# EAGLE design 2Cel_Bank (EAGLE 7.1.0)

## Sheet 1 of 2
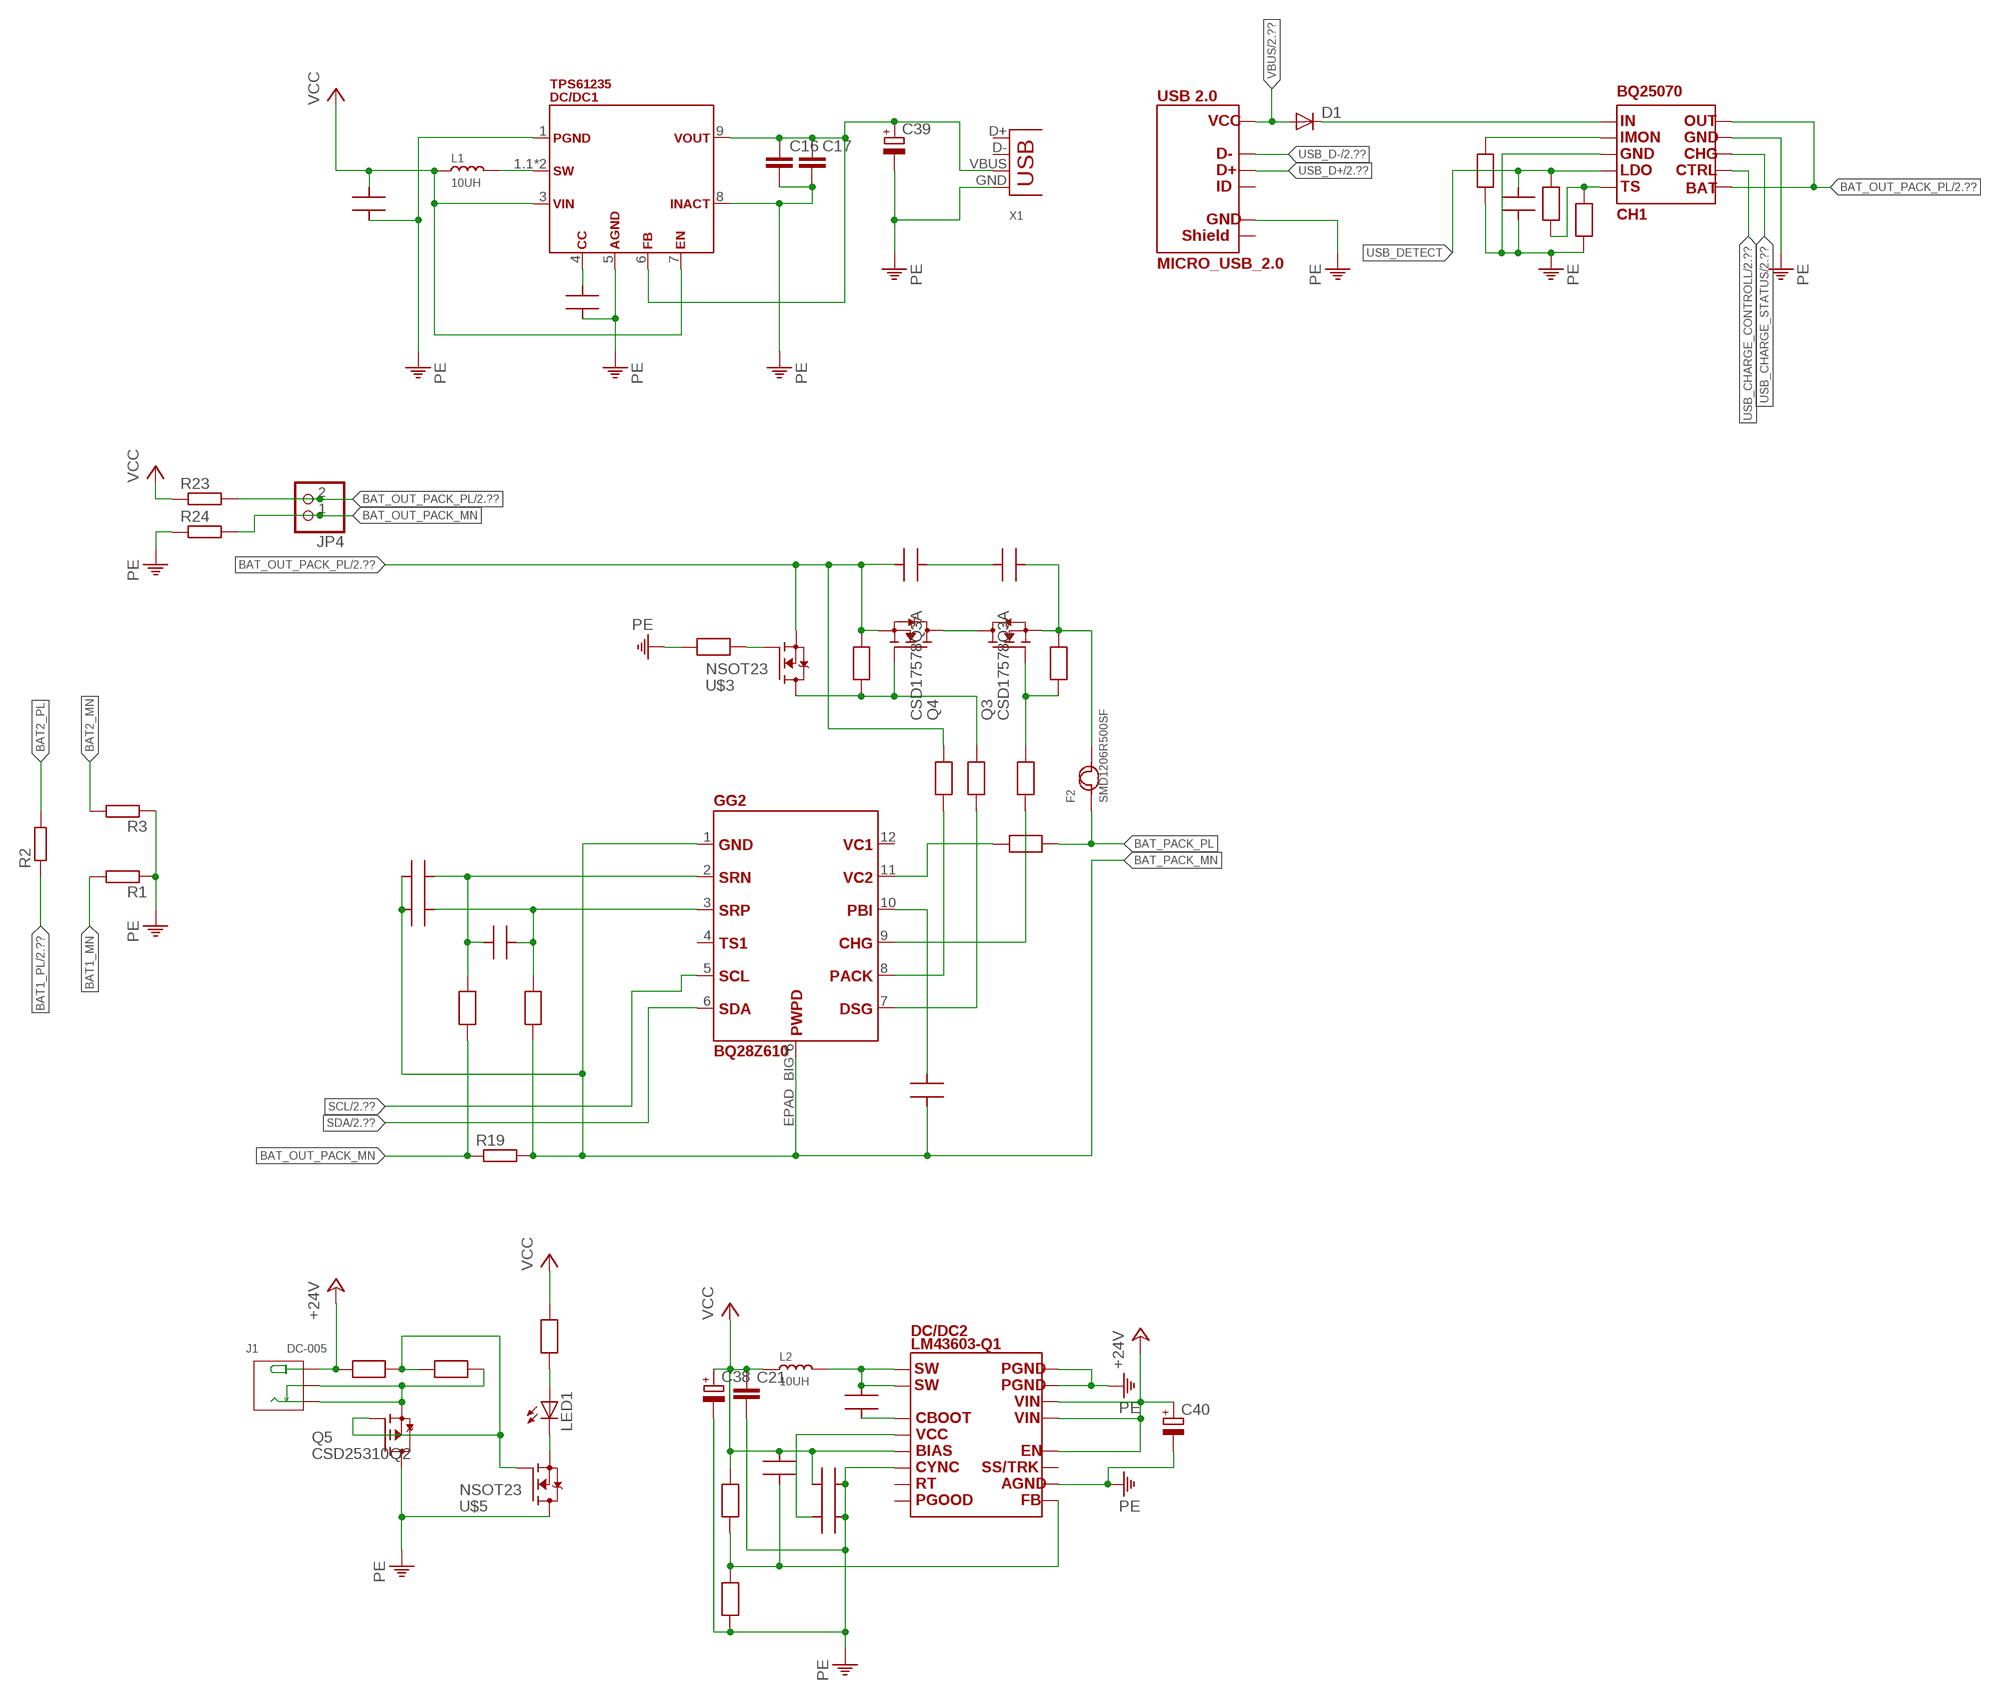
[diagram p0: schematic, sheet 1]

### Parts
C7  CAP0603  [C0603]
C8  CAP0603  [C0603]
C9  CAP0603  [C0603]
C10  CAP0603  [C0603]
C11  CAP0603  [C0603]
C12  CAP0603  [C0603]
C13  CAP0603  [C0603]
C14  CAP0603  [C0603]
C16  C-EUC0805  [C0805]
C17  C-EUC0805  [C0805]
C18  CAP0603  [C0603]
C19  CAP0603  [C0603]
C20  CAP0603  [C0603]
C21  C-EUC0805  [C0805]
C22  CAP0603  [C0603]
C33  CAP0603  [C0603]
C38  CPOL-EUSMCA  [SMC_A]
C39  CPOL-EUSMCA  [SMC_A]
C40  CPOL-EUSMCD  [SMC_D]
CH1  BQ25070  [DFN10_2X3]
D1  DIODE-DO-214AC  [DO-214AC]
DC/DC1  TPS61235  [VQFN9]
DC/DC2  LM43603-Q1  [HTSSOP16PWP]
F2  SMD1206R500SF  SMD-PPTC-500MA-15V(1812)  [F1812]
GG2  BQ28Z610  [VSON12]
J1  DC-005  CONN-POWER-JACK-2.1MM(DC-005)  [DCJ3P-14.2X11.0X9.0MM]
JP4  PINHD-1X2  [1X02]
L1  10UH  SMD-INDUCTOR-10UH-20%(2P-6X6MM)'0630'  [SMD-2P-L6.0XW6.0XH3.0MM]
L2  10UH  SMD-INDUCTOR-10UH-20%(2P-6X6MM)'0630'  [SMD-2P-L6.0XW6.0XH3.0MM]
LED1  LEDCHIP-LED0603  [CHIP-LED0603]
Q3  CSD17578Q3A  [VSONP8]
Q4  CSD17578Q3A  [VSONP8]
Q5  CSD25310Q2  [SON_Q2]
R1  R-EU_R1206  [R1206]
R2  R-EU_R1206  [R1206]
R3  R-EU_R1206  [R1206]
R11  RES0603  [R0603]
R12  RES0603  [R0603]
R13  RES0603  [R0603]
R14  RES0603  [R0603]
R15  RES0603  [R0603]
R16  RES0603  [R0603]
R17  RES0603  [R0603]
R18  RES0603  [R0603]
R19  R-EU_R1206  [R1206]
R20  RES0603  [R0603]
R22  RES0603  [R0603]
R23  R-EU_R1206  [R1206]
R24  R-EU_R1206  [R1206]
R25  RES0603  [R0603]
R26  RES0603  [R0603]
R27  RES0603  [R0603]
R28  RES0603  [R0603]
R29  RES0603  [R0603]
R30  RES0603  [R0603]
R31  RES0603  [R0603]
U$3  NSOT23  [SOT23W]
U$5  NSOT23  [SOT23W]
USB_CON1  MICRO_USB_2.0  [MICRO-USB5+4P-SMD-0.65]
X1  USB-A-S  [USB-A-S]

### Nets
+24V: C40.+ DC/DC2.12 DC/DC2.13 DC/DC2.14 J1.+ R25.2
BAT1_MN: R1.2
BAT1_PL: R2.1 ; also sheet 2
BAT2_MN: R3.2
BAT2_PL: R2.2
BAT_OUT_PACK_MN: JP4.1 R17.1 R19.1 R24.2
BAT_OUT_PACK_PL: C7.1 CH1.P$6 CH1.P$10 JP4.2 Q4.S1(S) Q4.S2(S) Q4.S3(S) R12.2 R15.2 R23.2 U$3.S ; also sheet 2
BAT_PACK_MN: C9.1 C10.2 C11.2 GG2.1 GG2.EPAD_BIG GG2.EPAD_M1 GG2.EPAD_M2 GG2.EPAD_M3 GG2.EPAD_M4 GG2.EPAD_VIA R18.1 R19.2
BAT_PACK_PL: F2.1 R20.1
N$11: C8.2 F2.2 Q3.S1(S) Q3.S2(S) Q3.S3(S) R11.2
N$16: Q3.D1(D) Q3.D2(D) Q3.D3(D) Q3.D4(D) Q3.D5(D) Q4.D1(D) Q4.D2(D) Q4.D3(D) Q4.D4(D) Q4.D5(D)
N$17: Q4.G R12.1 R13.2 U$3.D
N$18: Q3.G R11.1 R14.2
N$19: C7.2 C8.1
N$20: GG2.9 R14.1
N$21: GG2.7 R13.1
N$22: GG2.8 R15.1
N$23: R16.1 U$3.G
N$24: C9.2 GG2.10
N$25: C10.1 C12.2 GG2.2 R17.2
N$26: C11.1 C12.1 GG2.3 R18.2
N$28: GG2.11 R20.2
N$29: J1.-1(-) J1.-2(CDN) Q5.4(D) Q5.D R26.1
N$30: DC/DC1.1.1 DC/DC1.1.2 L1.2
N$31: Q5.3(G) R25.1 R26.2 U$5.G
N$32: C13.2 DC/DC1.4
N$33: C18.2 DC/DC2.1 DC/DC2.2 L2.2
N$34: C16.1 C17.1 C39.+ DC/DC1.6 DC/DC1.9 X1.VBUS
N$35: C18.1 DC/DC2.3
N$37: C19.2 DC/DC2.4
N$38: C22.2 DC/DC2.9 R27.2 R28.2
N$41: CH1.P$1 D1.C
N$42: CH1.P$2 R22.2
N$43: LED1.C U$5.S
N$44: CH1.P$5 R29.2 R30.1
N$46: LED1.A R31.2
PE: C13.1 C14.1 C16.2 C17.2 C19.1 C20.1 C21.2 C33.1 C38.- C39.- C40.- CH1.EPAD CH1.P$3 CH1.P$9 DC/DC1.1 DC/DC1.5 DC/DC1.8 DC/DC2.6 DC/DC2.10 DC/DC2.15 DC/DC2.16 DC/DC2.EXP Q5.1(S) Q5.2(S) Q5.5(S) Q5.6(S) Q5.S R1.1 R3.1 R16.2 R22.1 R24.1 R28.1 R29.1 U$5.D USB_CON1.5 X1.GND ; also sheet 2
SCL: GG2.5 ; also sheet 2
SDA: GG2.6 ; also sheet 2
USB_CHARGE_CONTROLL: CH1.P$7 ; also sheet 2
USB_CHARGE_STATUS: CH1.P$8 ; also sheet 2
USB_D+: USB_CON1.3 ; also sheet 2
USB_D-: USB_CON1.2 ; also sheet 2
USB_DETECT: C33.2 CH1.P$4 R30.2
VBUS: D1.A USB_CON1.1 ; also sheet 2
VCC: C14.2 C20.2 C21.1 C22.1 C38.+ DC/DC1.3 DC/DC1.7 DC/DC2.5 L1.1 L2.1 R23.1 R27.1 R31.1
Unconnected: DC/DC2.7 DC/DC2.8 DC/DC2.11 GG2.4 GG2.12 USB_CON1.4 USB_CON1.P$1 USB_CON1.P$2 USB_CON1.P$3 USB_CON1.P$4 X1.D+ X1.D-

## Sheet 2 of 2
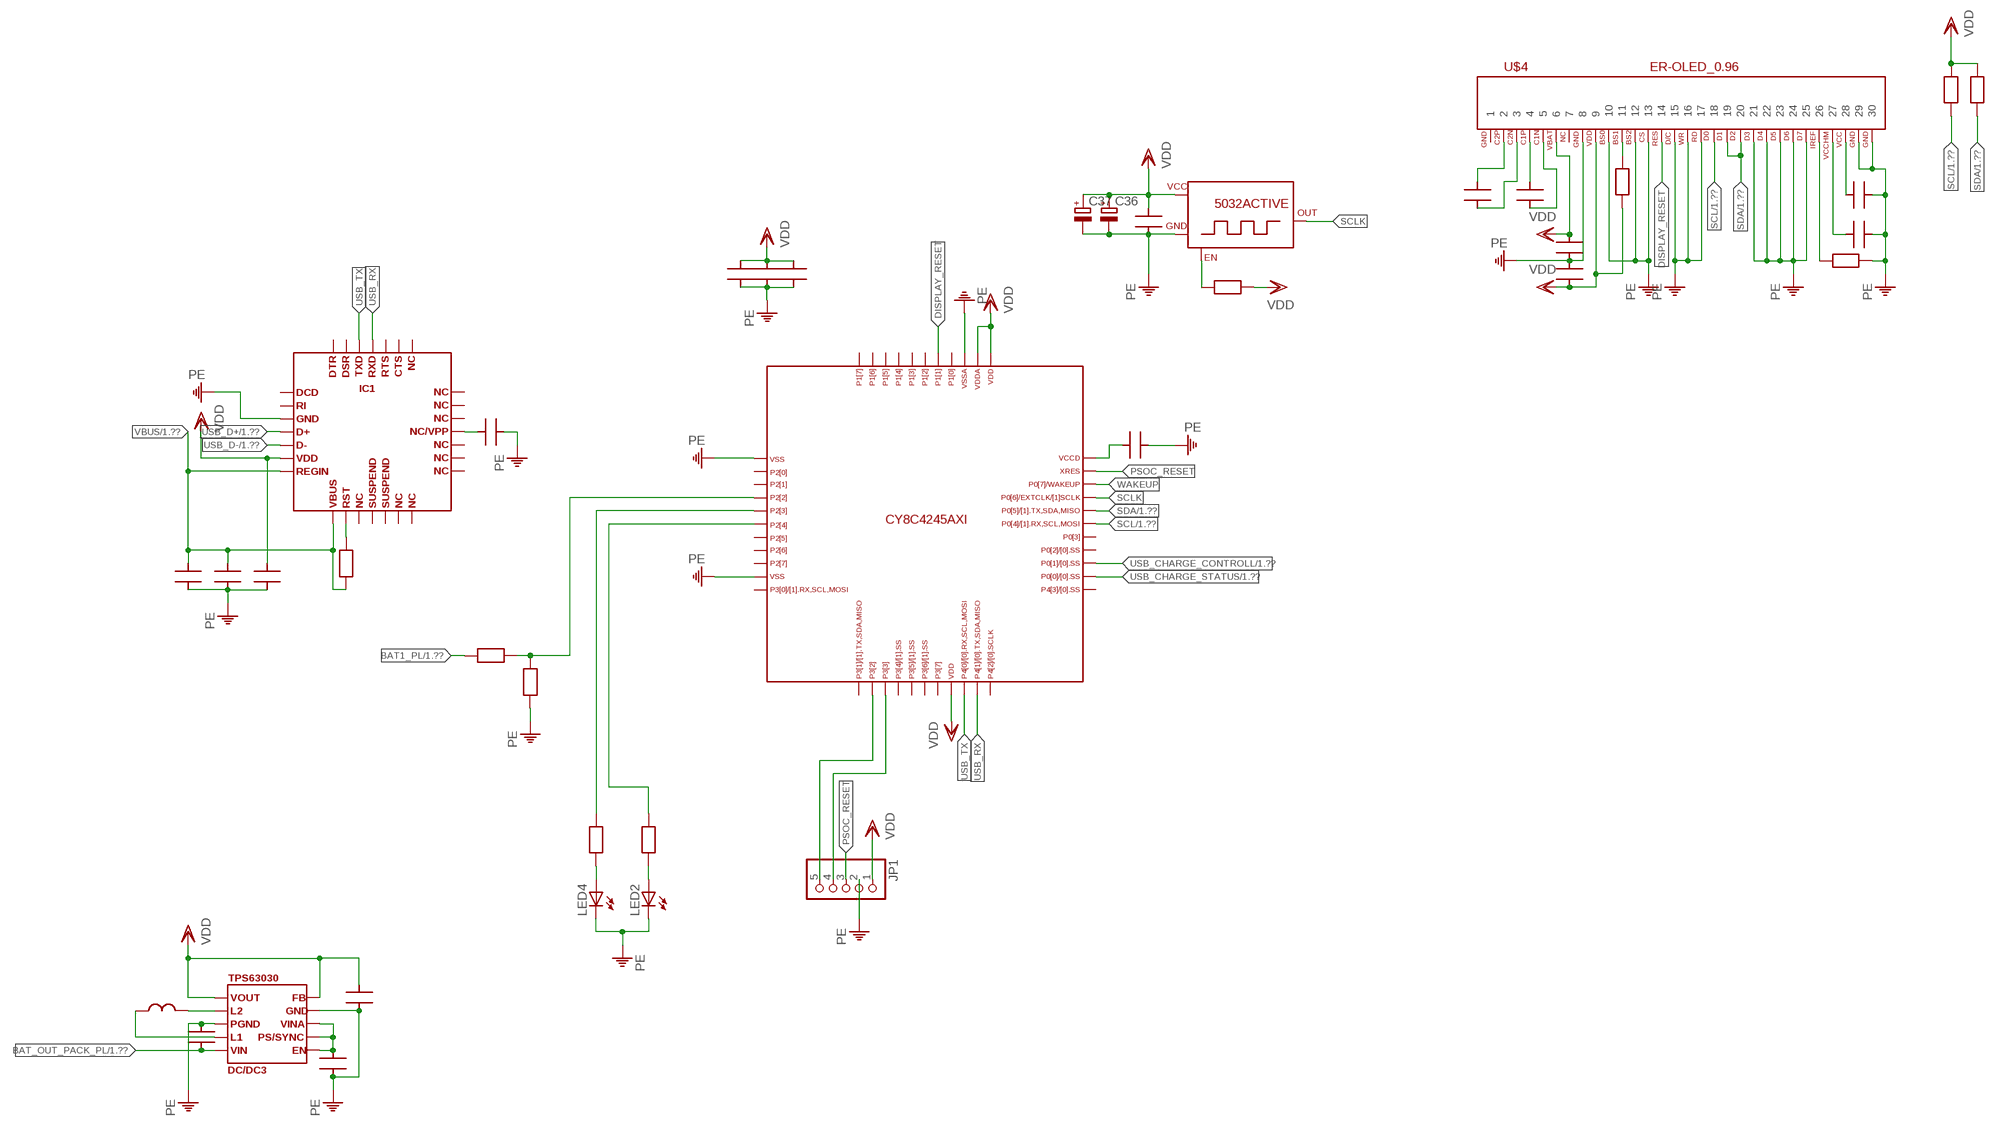
[diagram p1: schematic, sheet 2]

### Parts
C1  CAP0603  [C0603]
C2  CAP0603  [C0603]
C3  CAP0603  [C0603]
C4  CAP0603  [C0603]
C5  CAP0603  [C0603]
C6  CAP0603  [C0603]
C23  CAP0603  [C0603]
C24  CAP0603  [C0603]
C25  CAP0603  [C0603]
C26  CAP0603  [C0603]
C27  CAP0603  [C0603]
C28  CAP0603  [C0603]
C29  CAP0603  [C0603]
C30  CAP0603  [C0603]
C31  CAP0603  [C0603]
C32  CAP0603  [C0603]
C34  CAP0603  [C0603]
C35  CAP0603  [C0603]
C36  CPOL-EUSMCA  [SMC_A]
C37  CPOL-EUSMCA  [SMC_A]
DC/DC3  TPS63030  [WSON10]
IC1  CP2102/9  [QFN-28]
JP1  PINHD-1X5  [1X05]
L3  L0603  [L0603]
LED2  LEDCHIP-LED0603  [CHIP-LED0603]
LED4  LEDCHIP-LED0603  [CHIP-LED0603]
R4  RES0603  [R0603]
R5  RES0603  [R0603]
R6  RES0603  [R0603]
R7  RES0603  [R0603]
R8  RES0603  [R0603]
R9  RES0603  [R0603]
R10  RES0603  [R0603]
R21  RES0603  [R0603]
R32  RES0603  [R0603]
R33  RES0603  [R0603]
U$1  CY8C4245  [TQFP44_CY_LOGO]
U$2  5032ACTIVE  [5030A]
U$4  ER-OLED_0.96  [30PIN]

### Nets
BAT1_PL: R10.2 ; also sheet 1
BAT_OUT_PACK_PL: C30.2 DC/DC3.P$5 ; also sheet 1
DISPLAY_RESET: U$1.38 U$4.14
N$1: C1.2 IC1.18
N$2: IC1.9 R4.2
N$3: JP1.5 U$1.13
N$4: JP1.4 U$1.14
N$5: C5.2 U$1.33
N$6: R5.2 U$2.1(EN)
N$7: C23.1 U$4.2
N$8: C24.1 U$4.4
N$9: C23.2 U$4.3
N$10: C24.2 U$4.5
N$12: C28.1 U$4.27
N$13: R6.2 U$4.26
N$14: R10.1 R21.1 U$1.4
N$15: C27.1 U$4.28
N$27: R7.1 U$4.11
N$36: DC/DC3.P$2 L3.2
N$39: DC/DC3.P$4 L3.1
N$40: C29.1 DC/DC3.P$6 DC/DC3.P$7 DC/DC3.P$8
N$47: R33.1 U$1.5
N$48: LED2.A R32.2
N$49: LED4.A R33.2
N$50: R32.1 U$1.6
PE: C1.1 C2.2 C3.2 C4.2 C5.1 C6.2 C25.1 C26.2 C27.2 C28.2 C29.2 C30.1 C31.2 C32.2 C34.2 C35.2 C36.- C37.- DC/DC3.EPAD_B DC/DC3.EPAD_T DC/DC3.EPAD_VIA DC/DC3.P$3 DC/DC3.P$9 IC1.3 IC1.EPAD_B IC1.EPAD_T IC1.EPAD_VIA1 IC1.EPAD_VIA2 IC1.EPAD_VIA3 IC1.EPAD_VIA4 IC1.EPAD_VIA5 IC1.EPAD_VIA6 IC1.EPAD_VIA7 IC1.EPAD_VIA8 IC1.EPAD_VIA9 JP1.2 LED2.C LED4.C R6.1 R21.2 U$1.1 U$1.10 U$1.36 U$2.2(GND) U$4.8 U$4.10 U$4.12 U$4.13 U$4.15 U$4.16 U$4.17 U$4.21 U$4.22 U$4.23 U$4.24 U$4.25 U$4.29 U$4.30 ; also sheet 1
PSOC_RESET: JP1.3 U$1.32
SCL: R8.2 U$1.28 U$4.18 ; also sheet 1
SCLK: U$1.30 U$2.3(OUT)
SDA: R9.2 U$1.29 U$4.19 U$4.20 ; also sheet 1
USB_CHARGE_CONTROLL: U$1.25 ; also sheet 1
USB_CHARGE_STATUS: U$1.24 ; also sheet 1
USB_D+: IC1.4 ; also sheet 1
USB_D-: IC1.5 ; also sheet 1
USB_RX: IC1.25 U$1.21
USB_TX: IC1.26 U$1.20
VBUS: C2.1 C3.1 IC1.7 IC1.8 R4.1 ; also sheet 1
VDD: C4.1 C6.1 C25.2 C26.1 C31.1 C32.1 C34.1 C35.1 C36.+ C37.+ DC/DC3.P$1 DC/DC3.P$10 IC1.6 JP1.1 R5.1 R7.2 R8.1 R9.1 U$1.19 U$1.34 U$1.35 U$2.4(+5V) U$4.6 U$4.9
WAKEUP: U$1.31
Unconnected: IC1.1 IC1.2 IC1.10 IC1.11 IC1.12 IC1.13 IC1.14 IC1.15 IC1.16 IC1.17 IC1.19 IC1.20 IC1.21 IC1.22 IC1.23 IC1.24 IC1.27 IC1.28 U$1.2 U$1.3 U$1.7 U$1.8 U$1.9 U$1.11 U$1.12 U$1.15 U$1.16 U$1.17 U$1.18 U$1.22 U$1.23 U$1.26 U$1.27 U$1.37 U$1.39 U$1.40 U$1.41 U$1.42 U$1.43 U$1.44 U$4.1 U$4.7

## Library data of the parts
C1-C14 C18-C20 C22-C35 = My_RLC:CAP0603: Ceramic Capasitor SMD 0603
C16 C17 C21 = rcl:C-EU: CAPACITOR, European symbol
C36-C40 = rcl:CPOL-EU: POLARIZED CAPACITOR, European symbol
CH1 = My_TI:BQ25070: 1A, Single-Input, Single-Cell LiFePO4 Linear Battery Charger with 50mA LDO
D1 = diode:DIODE-: DIODE
DC/DC1 = My_TI:TPS61235: TPS61235 8-A Valley Current Synchronous Boost Converters with Constant Current Output Feature. • Up to 97% Efficiency Synchronous Boost. • Up to 3.5-A IOUT for 3.3-V to 5-V Conversion. • Fixed 5.1-V Output Voltage. Datasheet <http://www.ti.com/lit/ds/symlink/tps61235.pdf>
DC/DC2 = My_TI:LM43603-Q1: LM43603-Q1 SIMPLE SWITCHER® 3.5 V to 36 V 3 A Synchronous Step-Down Voltage Converter. Datasheet <http://www.ti.com/lit/ds/symlink/lm43603-q1.pdf>
DC/DC3 = My_TI:TPS63030: HIGH EFFICIENCY SINGLE INDUCTOR BUCK-BOOST CONVERTER WITH 1-A SWITCHES. Input Voltage Range: 1.8V to 5.5V. http://www.ti.com/lit/ds/symlink/tps63030.pdf
F2 = Seeed-OPL-fuse:SMD-PPTC-500MA-15V(1812): 307010007; MPN: SMD1206R500SF
GG2 = My_TI:BQ28Z610: BQ28Z610 Impedance Track™ Gas Gauge and Protection Solution for 1-Series to 2-Series Cell Li-Ion Battery Packs. • Cell Balancing with Internal Bypass To Optimize Battery Health. • High-Side Protection N-CH FET Drive Allows Serial Bus Communication During Fault Conditions. • Programmable Protection Levels for Voltage, Current, and Temperature. Datasheet <http://www.ti.com/lit/ds/symlink/bq28z610.pdf>
IC1 = Interface:CP2102/9: CP2102/9 SINGLE-CHIP USB TO UART BRIDGE. Integrated USB transceiver; no external resistors requied. Integrated clock; no external crystal required. Internal 1024-byte programmable ROM for vendor ID product ID, serial number, power descriptor, release number, and product description strings. - EEPROM (CP2102). - EPROM (One-time programmable) (CP2109). Datasheet <https://www.silabs.com/Support%20Documents/TechnicalDocs/CP2102-9.pdf>
J1 = Seeed-OPL-Connector:CONN-POWER-JACK-2.1MM(DC-005): 320120003; MPN: DC-005
JP1 = pinhead:PINHD-1X5: PIN HEADER
JP4 = pinhead:PINHD-1X2: PIN HEADER
L1 L2 = Seeed-OPL-Inductor:SMD-INDUCTOR-10UH-20%(2P-6X6MM): 303010016; MPN: CSAB0630-100M
L3 = My_RLC:L0603: Inductor SMD 0603
LED1 LED2 LED4 = led:LED: LED OSRAM: - CHIPLED LG R971, LG N971, LY N971, LG Q971, LY Q971, LO R971, LY R971 LH N974, LH R974 LS Q976, LO Q976, LY Q976 LO Q996 - Hyper CHIPLED LW Q18S LB Q993, LB Q99A, LB R99A - SideLED LS A670, LO A670, LY A670, LG A670, LP A670 LB A673, LV A673, LT A673, LW A673 LH A674 LY A675 LS A676, LA A676, LO A676, LY A676, LW A676 LS A679, LY A679, LG A679 - Hyper Micro SIDELED® LS Y876, LA Y876, LO Y876, LY Y876 LT Y87S - SmartLED LW L88C, LW L88S LB L89C, LB L89S, LG L890 LS L89K, LO L89K, LY L89K LS L896, LA L896, LO L896, LY L896 - TOPLED LS T670, LO T670, LY T670, LG T670, LP T670 LSG T670, LSP T670, LSY T670, LOP T670, LYG T670 LG T671, LOG T671, LSG T671 LB T673, LV T673, LT T673, LW T673 LH T674 LS T676, LA T676, LO T676, LY T676, LB T676, LH T676, LSB T676, LW T676 LB T67C, LV T67C, LT T67C, LS T67K, LO T67K, LY T67K, LW E67C LS E67B, LA E67B, LO E67B, LY E67B, LB E67C, LV E67C, LT E67C LW T67C LS T679, LY T679, LG T679 LS T770, LO T770, LY T770, LG T770, LP T770 LB T773, LV T773, LT T773, LW T773 LH T774 LS E675, LA E675, LY E675, LS T675 LS T776, LA T776, LO T776, LY T776, LB T776 LHGB T686 LT T68C, LB T68C - Hyper Mini TOPLED® LB M676 - Mini TOPLED Santana® LG M470 LS M47K, LO M47K, LY M47K Source: http://www.osram.convergy.de LUXEON: - LUMILED® LXK2-PW12-R00, LXK2-PW12-S00, LXK2-PW14-U00, LXK2-PW14-V00 LXK2-PM12-R00, LXK2-PM12-S00, LXK2-PM14-U00 LXK2-PE12-Q00, LXK2-PE12-R00, LXK2-PE12-S00, LXK2-PE14-T00, LXK2-PE14-U00 LXK2-PB12-K00, LXK2-PB12-L00, LXK2-PB12-M00, LXK2-PB14-N00, LXK2-PB14-P00, LXK2-PB14-Q00 LXK2-PR12-L00, LXK2-PR12-M00, LXK2-PR14-Q00, LXK2-PR14-R00 LXK2-PD12-Q00, LXK2-PD12-R00, LXK2-PD12-S00 LXK2-PH12-R00, LXK2-PH12-S00 LXK2-PL12-P00, LXK2-PL12-Q00, LXK2-PL12-R00 Source: www.luxeon.com KINGBRIGHT: KA-3528ASYC Source: www.kingbright.com
Q3 Q4 = Mosfet_Logic:CSD17578Q3A: 30 V N-Channel NexFET™ Power MOSFETs. 14/142A
Q5 = Mosfet_Logic:CSD25310Q2: CSD25310Q2 20 V P-Channel NexFET™ Power MOSFETs. Continuous Drain Current –9.6 A. Pulsed Drain Current 48 A. Datasheet <http://www.ti.com/lit/ds/symlink/csd25310q2.pdf>
R1-R3 R19 R23 R24 = rcl:R-EU_: RESISTOR, European symbol
R4-R18 R20-R22 R25-R33 = My_RLC:RES0603: Resistor SMD 0603
U$1 = PsoC:CY8C4245
U$2 = Oscillatrs:5032ACTIVE
U$3 U$5 = Mosfet_Logic:NSOT23
U$4 = Displays:ER-OLED_0.96
USB_CON1 = Interface:MICRO_USB_2.0: Micro USB 2.0
X1 = con-usb-3:USB: USB Connectors

## Board
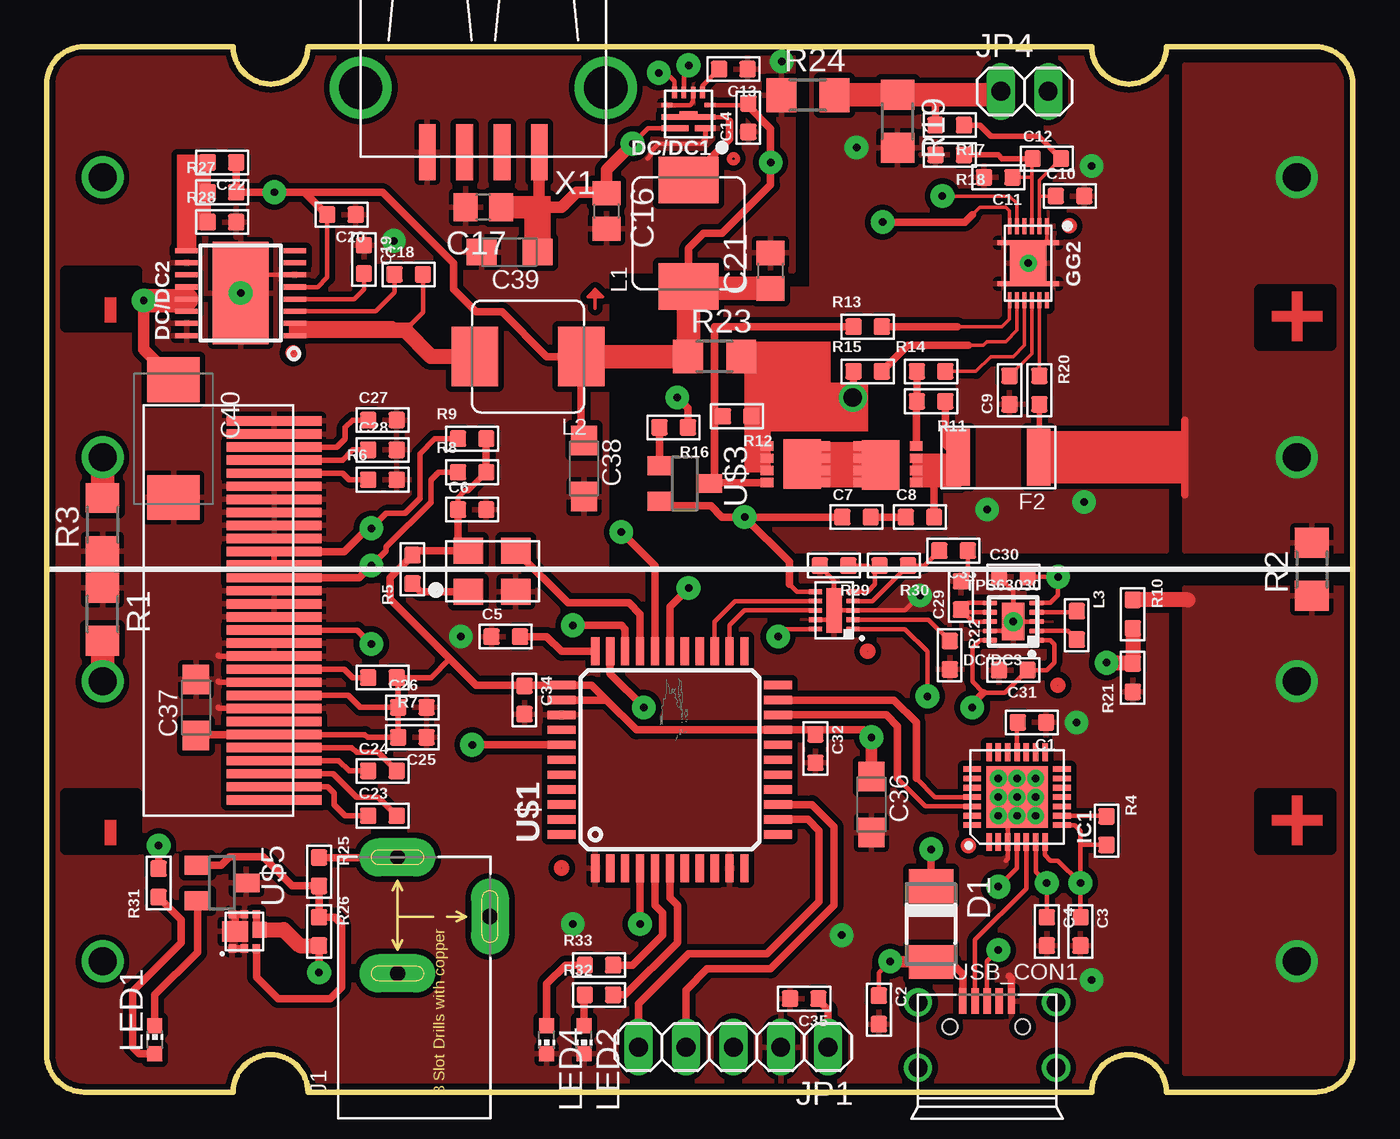
[diagram p2: board, top side]
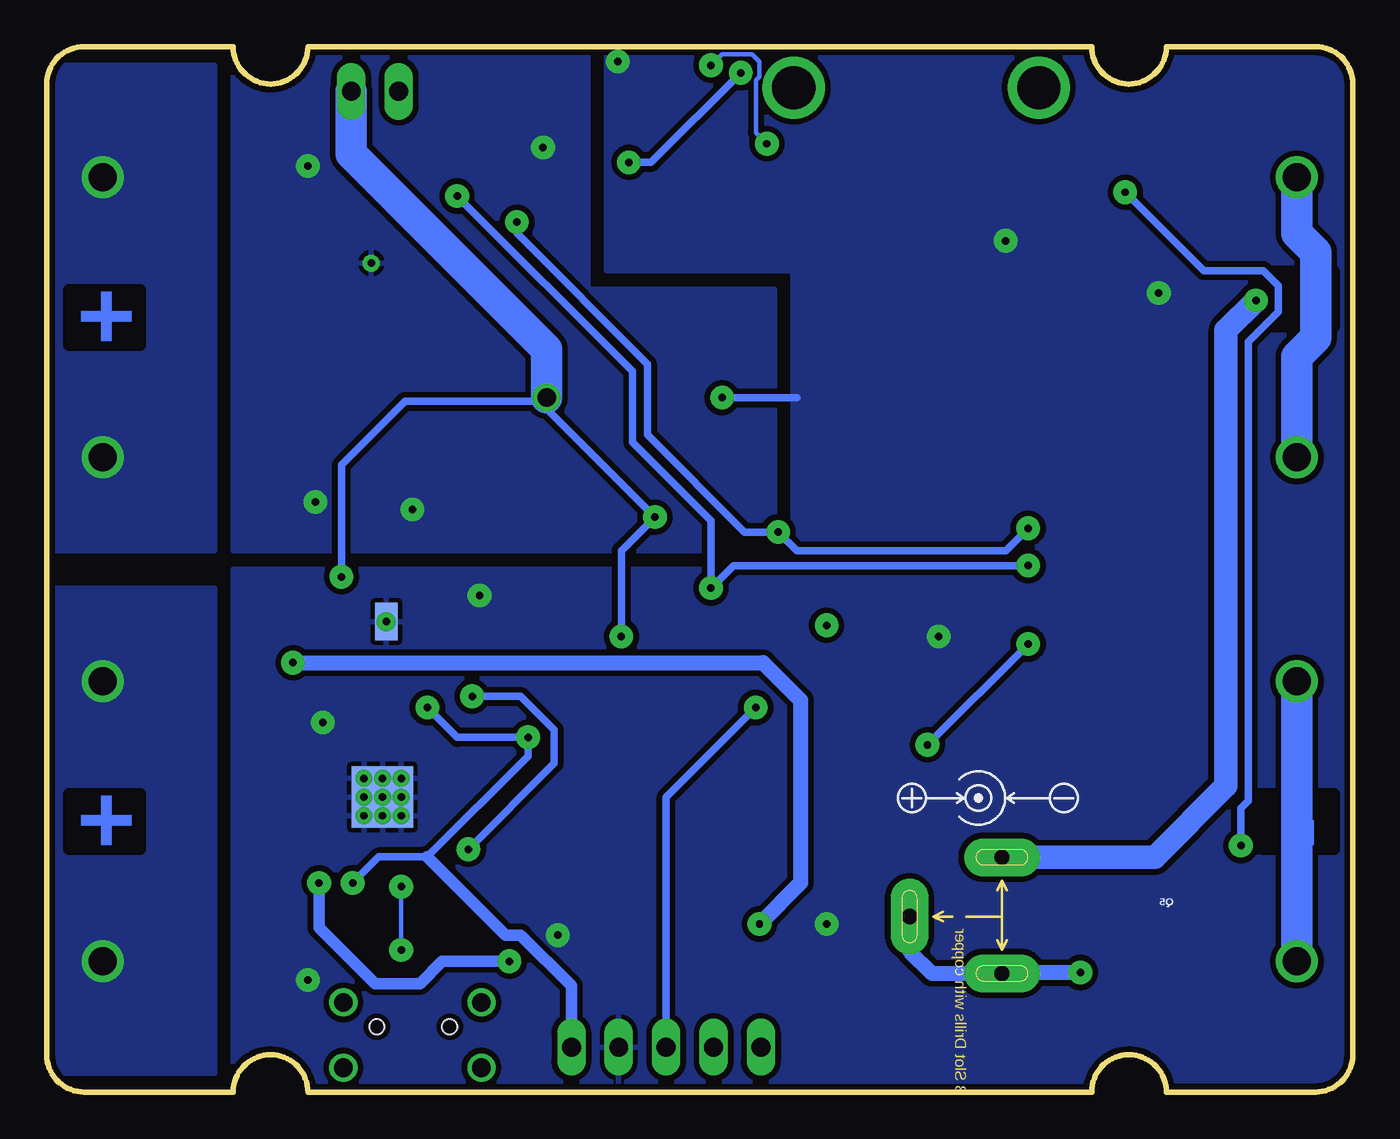
[diagram p3: board, bottom side, seen from below]

Size 70 x 56 mm. Coordinates in mm from the lower left corner, seen from the top.
Outline: 2,0 10,0 arc-90 12,2 arc-90 14,0 56,0 arc-90 58,2 arc-90 60,0 68,0 arc90 70,2 70,54 arc90 68,56 60,56 arc-90 58,54 arc-90 56,56 14,56 arc-90 12,54 arc-90 10,56 2,56 arc90 0,54 0,2 arc90 2,0
Copper layers (1*16): Top 0.035mm / dielectric 1.5mm / Bottom 0.035mm
Design rules "DIRTYCHEAP *": minimum track width 0.2mm, minimum drill 15mil, track to track 5mil, track to pad 5mil, pad to pad 5mil, via to via 5mil, smd to smd 0mil, copper to edge 10mil, drill to drill 10mil, minimum pad ring 10mil, minimum via ring 6mil, stop-mask expansion 2mil, vias tented up to drill 15mil, thermal gap 10mil

### Footprints (pad centres in the part's own frame; a part is rotated, then mirrored left to right if it is on the bottom)
C0603 = smd 0.889 x 0.889: 1 0,0.762; 2 0,-0.762
C0805 = smd 1.3 x 1.5: 1 -0.95,0; 2 0.95,0
SMC_A = smd 1.6 x 1.4: + -1.5,0; - 1.5,0
SMC_D = smd 2.4 x 2.8: + -3.15,0; - 3.15,0
DFN10_2X3 = smd 2.4 x 0.84: EPAD 0,0 | smd 0.25 x 0.7: P$1 -1,-1; P$2 -0.5,-1; P$3 0,-1; P$4 0.5,-1; P$5 1,-1; P$6 1,1; P$7 0.5,1; P$8 0,1; P$9 -0.5,1; P$10 -1,1
DO-214AC = smd 1.8 x 2.4: A 2.025,0; C -2.025,0
VQFN9 = smd 1.1 x 0.3: 1 -0.9,0.77 | smd 2.9 x 0.3: 1.1 0,0.17 | smd 0.975 x 0.15: 1.2 0,-0.065 | smd 0.6 x 0.25: 3 -1.15,-0.475; 8 1.15,-0.475 | smd 0.25 x 0.6: 4 -0.75,-1.15; 5 -0.25,-1.15; 6 0.25,-1.15; 7 0.75,-1.15 | smd 1.45 x 0.3: 9 0.725,0.77
HTSSOP16PWP = smd 0.27 x 1.2: 1 -2.275,-2.9; 2 -1.625,-2.9; 3 -0.975,-2.9; 4 -0.325,-2.9; 5 0.325,-2.9; 6 0.975,-2.9; 7 1.625,-2.9; 8 2.275,-2.9; 9 2.275,2.9; 10 1.625,2.9; 11 0.975,2.9; 12 0.325,2.9; 13 -0.325,2.9; 14 -0.975,2.9; 15 -1.625,2.9; 16 -2.275,2.9 | smd 5.5 x 3: EXP 0,0
WSON10 = smd 2 x 1.2 bottom: EPAD_B 0,0 | smd 2 x 1.2: EPAD_T 0,0 | drill 0.4 pad 1.016: EPAD_VIA 0,0 | smd 0.28 x 0.8: P$1 -1,-1.25; P$2 -0.5,-1.25; P$3 0,-1.25; P$4 0.5,-1.25; P$5 1,-1.25; P$6 1,1.25; P$7 0.5,1.25; P$8 0,1.25; P$9 -0.5,1.25; P$10 -1,1.25
F1812 = smd 1.27 x 3.048: 1 -2.159,0; 2 2.159,0
VSON12 = smd 0.2 x 0.85: 1 -1,-1.975; 2 -0.6,-1.975; 3 -0.2,-1.975; 4 0.2,-1.975; 5 0.6,-1.975; 6 1,-1.975; 7 1,1.975; 8 0.6,1.975; 9 0.2,1.975; 10 -0.2,1.975; 11 -0.6,1.975; 12 -1,1.975 | smd 1.95 x 2.45: EPAD_BIG 0,0 | smd 0.675 x 0.25: EPAD_M1 -1.312,1.1; EPAD_M2 -1.312,-1.1; EPAD_M3 1.312,-1.1; EPAD_M4 1.312,1.1 | drill 0.4: EPAD_VIA 0,0
QFN-28 = smd 0.95 x 0.3: 1 -2.4,1.5; 2 -2.4,1; 3 -2.4,0.5; 4 -2.4,0; 5 -2.4,-0.5; 6 -2.4,-1; 7 -2.4,-1.5; 15 2.4,-1.5; 16 2.4,-1; 17 2.4,-0.5; 18 2.4,0; 19 2.4,0.5; 20 2.4,1; 21 2.4,1.5 | smd 0.3 x 0.95: 8 -1.5,-2.4; 9 -1,-2.4; 10 -0.5,-2.4; 11 0,-2.4; 12 0.5,-2.4; 13 1,-2.4; 14 1.5,-2.4; 22 1.5,2.4; 23 1,2.4; 24 0.5,2.4; 25 0,2.4; 26 -0.5,2.4; 27 -1,2.4; 28 -1.5,2.4 | smd 3.3 x 3.3 bottom: EPAD_B 0,0 | smd 3.3 x 3.3: EPAD_T 0,0 | drill 0.4: EPAD_VIA1 -1,1; EPAD_VIA2 0,1; EPAD_VIA3 1,1; EPAD_VIA4 1,0; EPAD_VIA5 0,0; EPAD_VIA6 -1,0; EPAD_VIA7 -1,-1; EPAD_VIA8 0,-1; EPAD_VIA9 1,-1
DCJ3P-14.2X11.0X9.0MM = drill 0.813 pad 2.032 long: + 3.175,0; -1 -3.048,0; -2 0,-4.953
1X05 = drill 1.016 long: 1 -5.08,0; 2 -2.54,0; 3 0,0; 4 2.54,0; 5 5.08,0
1X02 = drill 1.016 long: 1 -1.27,0; 2 1.27,0
SMD-2P-L6.0XW6.0XH3.0MM = smd 2.5 x 3.2: 1 -2.85,0; 2 2.85,0
L0603 = smd 0.889 x 0.889: 1 -0.762,0; 2 0.762,0
CHIP-LED0603 = smd 0.8 x 0.8: A 0,-0.75; C 0,0.75
VSONP8 = smd 2.65 x 2.01: D1 -1,1.9 | smd 0.5 x 0.68: D2 0,3.03; D3 -0.65,3.03; D4 -1.3,3.03; D5 -1.95,3.03; G 0,0; S1 -1.95,0; S2 -1.3,0; S3 -0.65,0
SON_Q2 = smd 0.4 x 0.45: 1 -0.65,-0.922; 2 0,-0.922; 3 0.65,-0.922; 4 0.65,0.922; 5 0,0.922; 6 -0.65,0.922 | smd 0.75 x 0.85: D 0.825,0.096 | smd 1.4 x 1.1: S -0.505,0
R1206 = smd 1.6 x 1.803: 1 -1.422,0; 2 1.422,0
R0603 = smd 0.889 x 0.889: 1 0,0.762; 2 0,-0.762
TQFP44_CY_LOGO = smd 1.5 x 0.44: 1 -5.8,4; 2 -5.8,3.2; 3 -5.8,2.4; 4 -5.8,1.6; 5 -5.8,0.8; 6 -5.8,0; 7 -5.8,-0.8; 8 -5.8,-1.6; 9 -5.8,-2.4; 10 -5.8,-3.2; 11 -5.8,-4; 23 5.8,-4; 24 5.8,-3.2; 25 5.8,-2.4; 26 5.8,-1.6; 27 5.8,-0.8; 28 5.8,0; 29 5.8,0.8; 30 5.8,1.6; 31 5.8,2.4; 32 5.8,3.2; 33 5.8,4 | smd 0.44 x 1.5: 12 -4,-5.8; 13 -3.2,-5.8; 14 -2.4,-5.8; 15 -1.6,-5.8; 16 -0.8,-5.8; 17 0,-5.8; 18 0.8,-5.8; 19 1.6,-5.8; 20 2.4,-5.8; 21 3.2,-5.8; 22 4,-5.8; 34 4,5.8; 35 3.2,5.8; 36 2.4,5.8; 37 1.6,5.8; 38 0.8,5.8; 39 0,5.8; 40 -0.8,5.8; 41 -1.6,5.8; 42 -2.4,5.8; 43 -3.2,5.8; 44 -4,5.8
5030A = smd 1.6 x 1.4: 1 0,-2.2; 2 2.54,-2.2; 3 2.54,0; 4 0,0
SOT23W = smd 1 x 1.4: D 0,1.303; G -0.95,-1.303; S 0.95,-1.303
30PIN = smd 0.5 x 5.08: 1 -10.15,1; 2 -9.45,1; 3 -8.75,1; 4 -8.05,1; 5 -7.35,1; 6 -6.65,1; 7 -5.95,1; 8 -5.25,1; 9 -4.55,1; 10 -3.85,1; 11 -3.15,1; 12 -2.45,1; 13 -1.75,1; 14 -1.05,1; 15 -0.35,1; 16 0.35,1; 17 1.05,1; 18 1.75,1; 19 2.45,1; 20 3.15,1; 21 3.85,1; 22 4.55,1; 23 5.25,1; 24 5.95,1; 25 6.65,1; 26 7.35,1; 27 8.05,1; 28 8.75,1; 29 9.45,1; 30 10.15,1
MICRO-USB5+4P-SMD-0.65 = smd 0.4 x 1.35: 1 -1.3,2.675; 2 -0.65,2.675; 3 0,2.675; 4 0.65,2.675; 5 1.3,2.675 | drill 1: P$1 -3.7,2.6; P$2 3.7,2.6; P$3 -3.7,-0.9; P$4 3.7,-0.9 | hole 0.8: -2,1.3; 1.9,1.3
USB-A-S = smd 3 x 0.9: D+ 3.45,-1; D- 3.45,1; GND 3.45,-3; VBUS 3.45,3 | drill 2.311: P$5 0,-6.566; P$6 0,6.566

### Placement (x,y rotation side)
C1  52.8,19.8 270 top
C2  44.6,4.4 0 top
C3  55.4,8.6 0 top
C4  53.6,8.6 0 top
C5  24.6,24.4 90 top
C6  22.8,31.2 90 top
C7  43.4,30.8 90 top
C8  46.8,30.8 90 top
C9  51.6,37.6 180 top
C10  54.84,48 90 top
C11  51,49 270 top
C12  53.6,50 90 top
C13  36.8,54.8 270 top
C14  37.6,52.2 180 top
C16  30,47.2 270 top
C17  23.4,47.4 180 top
C18  19.4,43.8 90 top
C19  17,44.6 0 top
C20  15.8,47 270 top
C21  38.8,44 90 top
C22  9.4,49.8 270 top
C23  18,14.8 90 top
C24  18,17.2 90 top
C25  19.6,19 270 top
C26  19.6,20.6 90 top
C27  18,36 90 top
C28  18,34.4 90 top
C29  49,26.6 180 top
C30  51.8,27.6 90 top
C31  51.8,22.6 270 top
C32  41.2,18.4 0 top
C33  48.6,29 270 top
C34  25.6,21 0 top
C35  40.6,5 270 top
C36  44.2,15.4 270 top
C37  8,20.6 90 top
C38  28.8,33.4 270 top
C39  24.8,45 180 top
C40  6.8,35 270 top
CH1  42.2,25.8 90 top
D1  47.4,9 270 top
DC/DC1  34.4,52.4 180 top
DC/DC2  10.4,42.8 90 top
DC/DC3  51.8,25.2 90 top
F2  51,34 180 top
GG2  52.6,44.4 180 top
IC1  52,15.8 90 top
J1  18.8,9.4 90 top
JP1  36.8,2.4 180 top
JP4  52.4,53.6 0 top
L1  34.4,46 90 top
L2  25.8,39.4 180 top
L3  55.2,25 270 top
LED1  5.8,2.8 0 top
LED2  28.8,2.8 180 top
LED4  26.8,2.8 180 top
Q3  46.6,34.6 90 top
Q4  38.6,32.65 270 top
Q5  10.6,8.6 0 top
R1  3,25.6 270 top
R2  67.8,28 90 top
R3  3,30.4 90 top
R4  56.8,14 180 top
R5  19.6,28 0 top
R6  18,32.8 270 top
R7  18,22.2 90 top
R8  22.8,33.2 270 top
R9  22.8,35 270 top
R10  58.2,25.6 180 top
R11  47.4,37 90 top
R12  37,36.2 90 top
R13  44,41 270 top
R14  47.4,38.6 270 top
R15  44,38.6 270 top
R16  33.6,35.6 90 top
R17  48.4,51.8 90 top
R18  48.4,50.2 90 top
R19  45.6,52 270 top
R20  53.2,37.6 180 top
R21  58.2,22.2 0 top
R22  48.4,23.4 180 top
R23  35.8,39.4 0 top
R24  40.8,53.4 0 top
R25  14.6,11.8 180 top
R26  14.6,8.6 180 top
R27  9.4,48.2 270 top
R28  9.4,46.6 270 top
R29  42.2,28.2 90 top
R30  45.4,28.2 90 top
R31  6,11.2 0 top
R32  29.6,5.2 270 top
R33  29.6,6.8 270 top
U$1  33.4,17.8 90 top
U$2  22.6,29 0 top
U$3  34.2,32.6 270 top
U$4  13.2,25.8 90 top
U$5  9.4,11.2 270 top
USB_CON1  50.4,2.2 0 top
X1  23.4,53.8 270 top

### Tracks (layer width: path | path; a pad name or v marks a point on that pad's centre or on a via)
+24V  (via drill 0.4 pad 1.27)
  Top 0.254: DC/DC2.12 DC/DC2.13 DC/DC2.14
  Top 0.406: R25.2 18.79,12.56 J1.+
  Top 0.61: C40.+ 6.8,38.2 5.2,39.8 v5.2,42.4
  Top 1.27: v5.2,42.4 7.42,42.4 DC/DC2.13
  Bottom 1.27: J1.+ 10.62,12.57 6.8,16.4 6.8,40.8 v5.2,42.4
BAT1_MN  (via drill 1.5)
  Top 1.27: R1.2 v3,22
  Bottom 1.676: v3,7 v3,22
BAT1_PL  (via drill 1.5)
  Top 0.305: 61.16,26.36 61.2,26.4
  Top 0.813: 61.16,26.36 R10.2
  other vias: 67,22 67,7
  pour Top (isolate 0.305): 61,27 70,27 70,1 61,1
  pour Bottom (isolate 0.305): 70,27 61,27 61,1 70,1
BAT2_MN  (via drill 1.5)
  Top 1.27: v3,34 R3.2
  Bottom 1.676: v3,34 3,39.4 2,40.4 2,45 3,46 v3,49
BAT2_PL  (via drill 1.5)
  Top 0.406: 61,36 61,32
  other vias: 67,49 67,34
  pour Top (isolate 0.305): 61,55 70,55 70,29 61,29
  pour Bottom (isolate 0.305): 70,55 61,55 61,29 70,29
BAT_OUT_PACK_MN
  Top 0.406: R17.1 47.64,53.06 48,53.42
  Top 1.27: JP4.1 50.95,53.42 48,53.42 R19.1 42.24,53.42 R24.2
BAT_OUT_PACK_PL  (via drill 0.4 pad 1.27, 1 pad 1.27)
  Top 0.254: R23.2 37.8,39.4 | DC/DC3.P$5 53.8,26.2 54.2,26.6 v54.2,27.6 C30.2 | CH1.P$6 40.2,26.8 39.8,27.2 | CH1.P$10 39.6,24.8 v39.2,24.4
  Top 0.406: R15.2 43.24,37.24 v43.2,37.2 42.2,36.2 38.6,36.2 | v37.4,30.8 C7.1 | U$3.S 33.15,31.4 35.6,31.4 36.2,30.8 v37.4,30.8 | 38.6,36.2 R12.2 37.8,36.24 37.8,39.4 | Q4.S3 Q4.S2 Q4.S1 38.6,36.2 | 39.8,27.2 39.8,28.4 v37.4,30.8
  Bottom 0.406: v54.2,27.6 54.2,33.6 50.8,37 43.4,37 v43.2,37.2 43.2,36.6 v37.4,30.8 39.2,29 v39.2,24.4
  Bottom 1.676: JP4.2 53.67,50.27 43.2,39.8 v43.2,37.2
BAT_PACK_MN  (via drill 0.4 pad 1.27)
  Top 0.2: GG2.1 53.6,45.6 | 53.6,45.6 53.2,45.2 | GG2.EPAD_M2 53.7,45.5 53.6,45.6
  other vias: 56,49.6 55.6,31.6 50.4,31.2 43.4,50.6
  pour Bottom (isolate 0.305): 41,56 41,43 31,43 31,29 60,29 60,56
  pour Top (isolate 0.305): 41,56 41,43 31,43 31,29 60,29 60,56
BAT_PACK_PL
  Top 0.305: R20.1 53.2,34.04 F2.1
DISPLAY_RESET  (via drill 0.4 pad 1.27)
  Top 0.305: U$4.14 16.65,24.75 v17.4,24
  Top 0.406: v22.8,18.6 U$1.38
  Bottom 0.406: v17.4,24 v22.8,18.6
N$1
  Top 0.254: IC1.18 52,19.76 C1.2
N$2
  Top 0.254: IC1.9 56.76,14.8 R4.2
N$3
  Top 0.406: U$1.13 40.8,14.6 41.4,14 41.4,10.2 38.6,7.4 34.4,7.4 31.72,4.72 JP1.5
N$4
  Top 0.406: U$1.14 41,15.4 42.2,14.2 42.2,10 38.8,6.6 35.4,6.6 34.26,5.46 JP1.4
N$5
  Top 0.406: U$1.33 27.6,23.6 26.8,24.4 C5.2
N$6
  Top 0.406: U$2.1 20.04,26.8 R5.2
N$7
  Top 0.305: U$4.2 15.05,16.35 15.4,16 15.4,15.4 16,14.8 C23.1
N$8
  Top 0.305: U$4.4 15.65,17.75 16.2,17.2 C24.1
N$9
  Top 0.305: U$4.3 15.35,17.05 16.6,15.8 17.76,15.8 C23.2
N$10
  Top 0.305: U$4.5 16.35,18.45 16.6,18.2 17.76,18.2 C24.2
N$11
  Top 0.406: R11.2 48.16,34.68 F2.2 48.79,33.95 47.6,33.95 | Q3.S1 Q3.S2 Q3.S3 47.6,33.95 | C8.2 47.56,33.91 47.6,33.95
N$12
  Top 0.305: U$4.27 15.85,33.85 16.4,34.4 C28.1
N$13
  Top 0.305: U$4.26 15.85,33.15 16.2,32.8 R6.2
N$14  (via drill 0.4 pad 1.27)
  Top 0.406: v31.8,9 U$1.4
  Top 0.813: R10.1 R21.1 56.84,22.96 v56.8,23
  Bottom 0.813: v56.8,23 31.6,23 29.6,21 29.6,11.2 v31.8,9
N$15
  Top 0.305: U$4.28 15.55,34.55 16,35 16,35.6 16.4,36 C27.1
N$16
  Top 0.406: Q4.D4 Q4.D5 Q3.D2 Q3.D3 Q3.D4 | Q4.D4 Q4.D3 Q4.D2 | Q4.D4 40.8,33.95 Q4.D1 | Q3.D4 Q3.D5 | Q3.D4 44.4,33.3 Q3.D1
N$17
  Top 0.406: Q4.G 35.55,32.65 U$3.D 35.8,32.9 35.8,36.4 | R13.2 35.8,41 35.8,36.4 | R12.1 36,36.2 35.8,36.4
N$18
  Top 0.406: R14.2 R11.1 46.6,36.96 Q3.G
N$19
  Top 0.406: C7.2 C8.1
N$20
  Top 0.2: GG2.9 52.4,40 51.8,39.4 50.6,39.4 49.8,38.6 R14.1
N$21
  Top 0.2: GG2.7 51.6,41.4 51.2,41 48.8,41
  Top 0.406: 48.8,41 R13.1
N$22
  Top 0.2: GG2.8 52,40.8 51.4,40.2 50.4,40.2 50.2,40 49.4,40
  Top 0.406: 49.4,40 46.16,40 R15.1
N$23
  Top 0.406: R16.1 32.84,33.61 U$3.G
N$24
  Top 0.2: GG2.10 52.8,39.56 C9.2
N$25
  Top 0.2: GG2.2 53.2,48 | 53.2,48 53.2,48.84 C12.2 | C10.1 53.2,48
  Top 0.305: R17.2 50,51.8 50.6,51.2 53.16,51.2 C12.2
N$26
  Top 0.2: GG2.3 52.8,49 | 52.8,49 52.8,49.96 C12.1 | C11.1 52.8,49
  Top 0.305: R18.2 51,50.2 51.2,50 C12.1
N$27
  Top 0.305: U$4.11 15.95,22.65 16.4,22.2 R7.1
N$28
  Top 0.2: GG2.11 R20.2
N$29  (via drill 0.4 pad 1.27)
  Top 0.406: R26.1 v14.6,6.4 | Q5.4 11.25,8.87 Q5.D
  Top 0.813: Q5.D 12.7,8.7 13.56,7.84 R26.1
  Bottom 0.813: v14.6,6.4 18.75,6.4 J1.-1 22.55,6.35 23.75,7.55 J1.-2
N$30
  Top 0.1: DC/DC1.1.2 DC/DC1.1.1
  Top 0.254: DC/DC1.1.1 36.37,52.23 36.6,52
  Top 0.406: 36.6,52 36.6,51.05 L1.2
N$31
  Top 0.406: Q5.3 11.25,6.15 12.4,5 15.2,5 15.8,5.6 15.8,9 15.44,9.36 R26.2 R25.1 13.16,11.04 11.6,12.6 9.8,12.6 9.35,12.15 U$5.G
N$32
  Top 0.254: DC/DC1.4 35.15,53.91 C13.2
N$33
  Top 0.254: C18.2 20.16,41.76 19.2,40.8 18.95,40.8 18.57,41.17 DC/DC2.2 DC/DC2.1
  Top 0.813: L2.2 20.6,39.4 19.2,40.8
N$34  (via drill 0.4 pad 1.27)
  Top 0.254: DC/DC1.6 34.15,54.75 v34.4,55 | v31.4,50.8 32.23,51.63 DC/DC1.9
  Top 0.61: v31.4,50.8 30,49.4 C16.1 29.95,48.2 28.4,48.2 27.6,47.4 26.4,47.4 | X1.VBUS 26.4,47.4 | 26.4,47.4 26.4,45.1 C39.+ | C17.1 26.4,47.4
  Bottom 0.254: v34.4,55 33.8,55.6 32.2,55.6 31.8,55.2 31.8,54.4 32,54.2 32,51.4 v31.4,50.8
N$35
  Top 0.254: DC/DC2.3 17.62,41.83 18.64,42.84 C18.1
N$36
  Top 0.254: DC/DC3.P$2 54.74,24.7 L3.2
N$37
  Top 0.254: DC/DC2.4 16.48,42.48 17,43 C19.2
N$38
  Top 0.254: C22.2 R27.2 R28.2 8.64,48.16 8.6,48.2 7.8,48.2 7.5,47.9 DC/DC2.9
N$39
  Top 0.254: DC/DC3.P$4 55.14,25.7 L3.1
N$40
  Top 0.254: DC/DC3.P$8 49.64,25.2 C29.1 | DC/DC3.P$6 49.36,26.2 C29.1 | DC/DC3.P$7 49.14,25.7 C29.1
N$41  (via drill 0.4 pad 1.27)
  Top 0.254: CH1.P$1 46,24.8 47.2,23.6 v47.2,21.2
  Top 0.406: v47.4,13 D1.C
  Bottom 0.406: v47.2,21.2 44.6,21.2 42.8,19.4 42.8,17.6 v47.4,13
N$42
  Top 0.254: CH1.P$2 47.26,25.3 R22.2
N$43
  Top 0.406: LED1.C 5.8,5.2 8.1,7.5 U$5.S
N$44
  Top 0.254: CH1.P$5 44,26.8 44.4,27.2 44.4,27.8 44.3,27.9 | 44.3,27.9 44,28.2 R29.2 | R30.1 44.6,28.2 44.3,27.9
N$46
  Top 0.406: LED1.A 4.95,2.05 4.6,2.4 4.6,5.4 7.2,8 7.2,9.24 R31.2
N$47
  Top 0.406: U$1.5 32.6,10 33,9.6 33,8.4 31.4,6.8 R33.1
N$48
  Top 0.406: LED2.A 28.8,5.16 R32.2
N$49
  Top 0.406: R33.2 27.8,6.8 26.8,5.8 LED4.A
N$50
  Top 0.406: U$1.6 33.4,10.4 33.8,10 33.8,8 31,5.2 R32.1
N$51
  Top 0.2: 29.4,42.8 29.4,42 | 29.4,43 29.8,42.6 29.6,42.6 | 29.4,42.6 29,42.6 29.2,42.8 | 29.2,42.8 29.4,43 | 29.4,43 29.4,42.8 | 29.4,42.8 29.6,42.6 | 29.6,42.6 29.4,42.6 | 29.4,42.6 29.2,42.8
PE  (via drill 0.4 pad 1.27)
  Top 0.254: DC/DC2.6 10.43,43.77 10.4,43.8 DC/DC2.EXP | 51.4,12.4 51.5,12.5 IC1.3 51.5,14.4 51.1,14.8 IC1.EPAD_VIA1 | IC1.EPAD_VIA6 IC1.EPAD_VIA7 | IC1.EPAD_VIA8 IC1.EPAD_VIA9 | IC1.EPAD_VIA3 IC1.EPAD_VIA2 | DC/DC3.P$3 DC/DC3.EPAD_VIA | DC/DC3.P$9 51.3,24.7 DC/DC3.EPAD_VIA | CH1.EPAD CH1.P$3 46,25.8 v46.8,26.6 | CH1.P$9 42.1,25.3 42.2,25.2 CH1.EPAD | R29.1 41.44,28.16 42.2,27.4 CH1.EPAD | DC/DC3.EPAD_VIA 51.8,26.84 C30.1 | C33.1 49.36,27.72 C29.2 | DC/DC1.8 34.48,52.88 34.65,53.05 DC/DC1.5 | 35.2,51 35.3,51.1 DC/DC1.1 35.3,50.9 35.2,50.8 32.8,50.8 32.4,50.4 32.4,50.2 32.2,50
  Top 0.305: U$4.8 9.25,20.55 9.2,20.6 | U$4.12 9.25,23.35 9.2,23.4 | U$4.10 9.25,21.95 9.2,22
  Top 0.406: R16.2 34.36,36.64 v33.8,37.2 | USB_CON1.5 51.7,6.1 51.6,6.2 | IC1.EPAD_VIA6 51.9,14.8 51.5,14.4 | Q5.5 Q5.6 10.1,9.38 Q5.S | Q5.2 Q5.1
  Top 1.27: R1.1 R3.1
  Bottom 0.406: 33.8,37.6 v33.8,37.2 29.8,37.2
  other vias: 39.4,55.2 10.4,42.8 18.6,45.6 55.2,19.8 56,6 42.6,8.4 28.2,9 22.2,24.4
  pour Top (isolate 0.305): 0,0 60,0 60,28 30,28 30,44 40,44 40,56 0,56
  pour Bottom (isolate 0.305): 0,0 60,0 60,28 30,28 30,44 40,44 40,56 0,56
PSOC_RESET  (via drill 0.4 pad 1.27)
  Top 0.406: v32,20.6 30.2,22.4 U$1.32
  Bottom 0.406: JP1.3 36.8,15.8 v32,20.6
SCL  (via drill 0.4 pad 1.27)
  Top 0.2: GG2.5 52,47.6 51.6,48 v48,48
  Top 0.305: R8.2 21,33.2 20.6,32.8 20.6,31.6 18.2,29.2 18.2,29 v17.4,28.2
  Top 0.406: U$4.18 16.75,27.55 v17.4,28.2 | v34.4,27 33.4,26 U$1.28
  Bottom 0.406: v17.4,28.2 33.2,28.2 v34.4,27 34.4,30.6 38.6,34.8 38.6,38.6 v48,48
SCLK
  Top 0.406: U$1.30 31.8,25.6 31.2,26.2 27.94,26.2 U$2.3
SDA  (via drill 0.4 pad 1.27)
  Top 0.2: GG2.6 51.6,47.2 51.4,47.4 50,47.4 49.6,47
  Top 0.305: U$4.20 U$4.19 | R9.2 20.8,35 20,34.2 20,31.8 19.2,31 18.2,31 v17.4,30.2
  Top 0.406: U$1.29 32.6,28.2 v30.8,30 | v17.4,30.2 17.2,30.2 15.95,28.95 U$4.20 | 49.6,47 49.2,46.6 v44.8,46.6
  Bottom 0.406: v17.4,30.2 18.6,29 29.8,29 v30.8,30 32.6,30 37.8,35.2 37.8,39 44.8,46 v44.8,46.6
USB_CHARGE_CONTROLL
  Top 0.254: CH1.P$7 36.9,26.3 35.8,25.2 U$1.25
USB_CHARGE_STATUS
  Top 0.254: CH1.P$8 37.4,25.8 36.6,25 U$1.24
USB_D+  (via drill 0.4 pad 1.27)
  Top 0.254: USB_CON1.3 50.4,7 v51,7.6 | v51,11 52,12 IC1.4
  Bottom 0.254: v51,7.6 v51,11
USB_D-
  Top 0.254: USB_CON1.2 49.75,8.15 52.5,10.9 IC1.5
USB_DETECT
  Top 0.254: CH1.P$4 44.26,26.3 R30.2 47.04,28.2 C33.2
USB_RX
  Top 0.254: IC1.25 47.6,15.8 46.6,16.8
  Top 0.406: 46.6,16.8 46.6,19.8 45.4,21 U$1.21
USB_TX
  Top 0.254: IC1.26 47.1,15.3 45.6,16.8
  Top 0.406: 45.6,16.8 45.6,19.6 45,20.2 U$1.20
VBUS  (via drill 0.4 pad 1.27)
  Top 0.254: IC1.8 55.1,14.3 55.4,14 55.4,13.2 | 55.4,13.2 v55.4,11.2 | IC1.7 53.5,12.7 53.8,12.4 54.2,12.4 v55.4,11.2 | R4.1 55.44,13.24 55.4,13.2 | C3.1 v55.4,11.2 | C2.1 44.6,6.4 v45.2,7
  Top 0.406: USB_CON1.1 49.1,6.3 48.42,6.97 D1.A
  Top 0.61: 48.42,6.97 45.23,6.97 v45.2,7
  Bottom 0.61: v45.2,7 48.8,7 50,5.8 52.4,5.8 55.4,8.8 v55.4,11.2
VCC  (via drill 0.4 pad 1.27)
  Top 0.254: C20.2 15.04,43.64 14.53,43.12 DC/DC2.5 | DC/DC1.3 37.51,52.88 C14.2 | DC/DC1.7 33.65,54.15 33.4,54.4 33,54.4 v32.8,54.6
  Top 0.406: C22.1 R27.1 v12.2,48.2 13.8,48.2 | 13.8,48.2 13.84,48.2 | 13.84,48.2 C20.2 15,47 13.8,48.2 | 13.84,48.2 18,48.2 21.8,44.4 21.8,43 23,41.8 24.4,41.8 26.8,39.4 L2.1 28.65,35.05 C38.+ | R31.1 v6,13.2 | L1.1 34.4,45.2 35.2,46 36.2,46 38.8,48.6 v38.8,49.8 38.8,51.6 37.6,52.8 C14.2
  Top 1.27: L2.1 R23.1 34.4,39.42 L1.1 34.5,43.05 C21.1
  Bottom 0.406: v6,13.2 6,15.2 5.6,15.6 5.6,40.2 4,41.8 4,43.2 4.8,44 8,44 v12.2,48.2 | v38.8,49.8 37.6,49.8 v32.8,54.6
VDD  (via drill 0.4 pad 1.27)
  Top 0.254: IC1.6 53,11.8 v53.6,11.2 C4.1 | DC/DC3.P$1 53.8,24.2 54,24 54,23 53.6,22.6 C31.1 51.36,21.4 50.2,21.4 49.6,22 49.6,23.8 50,24.2 DC/DC3.P$10
  Top 0.305: 21.6,23.2 20.6,22.2 R7.2 18.84,22.12 C26.1 | U$4.6 17.05,19.15 17.2,19 C25.2 C26.1 | U$4.9 16.15,21.25 16.8,20.6 C26.1 | C6.1 22.04,31.84 22.4,32.2 22.56,32.2 R8.1 | C34.1 25.6,21.6 25.4,21.8 | C32.1 41.2,19.4
  Top 0.406: v44.2,19 43.8,19.4 41.2,19.4 U$1.19 31.6,19.4 30,21 | 30,21 U$1.35 | 30,21 29.2,21.8 U$1.34 25.4,21.8 23,21.8 21.6,23.2 18.4,26.4 18.4,27.56 R5.1 19.84,29 U$2.4 22.04,29.56 C6.1 | v49.6,20.6 49.6,20.8 50.2,21.4 | R9.1 R8.1 | C35.1 41.36,4.92 41.88,4.4 JP1.1 | U$4.6 8.05,19.15 C37.+
  Top 0.61: C36.+ v44.2,19
  Bottom 0.406: v53.6,11.2 52.2,12.6 49.6,12.6 44.2,18 v44.2,19 48,19 v49.6,20.6
  Bottom 0.61: JP1.1 41.88,5.68 44.6,8.4 45.4,8.4 49.6,12.6
WAKEUP  (via drill 0.4 pad 1.27)
  Top 0.406: U$1.31 31,24.8 30.8,25 v28.2,25
(copper drawn outside any net)
  shapes: Top area x14, Top circle x7

### Text on the board
Top: - | + | - | +
Bottom: - | + | - | +
tStop: 30 | 1